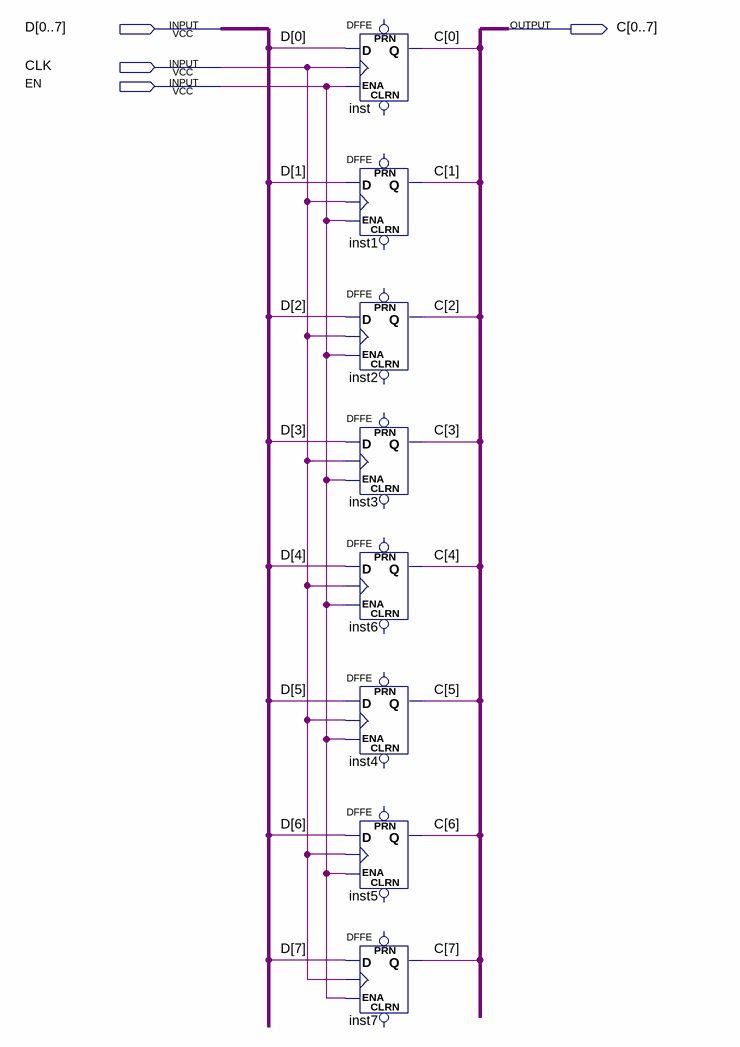
[diagram p0: schematic sheet]
// Quartus schematic reg8bit.bdf as structural Verilog: 8 symbols, 4 pins
module reg8bit (
  input  [0:7] D,
  input  CLK,
  input  EN,
  output [0:7] C
);

  DFFE inst (.D(D[0]), .CLK(CLK), .ENA(EN), .Q(C[0]));  // open: PRN, CLRN
  DFFE inst1 (.D(D[1]), .CLK(CLK), .ENA(EN), .Q(C[1]));  // open: PRN, CLRN
  DFFE inst2 (.D(D[2]), .CLK(CLK), .ENA(EN), .Q(C[2]));  // open: PRN, CLRN
  DFFE inst3 (.D(D[3]), .CLK(CLK), .ENA(EN), .Q(C[3]));  // open: PRN, CLRN
  DFFE inst6 (.D(D[4]), .CLK(CLK), .ENA(EN), .Q(C[4]));  // open: PRN, CLRN
  DFFE inst4 (.D(D[5]), .CLK(CLK), .ENA(EN), .Q(C[5]));  // open: PRN, CLRN
  DFFE inst5 (.D(D[6]), .CLK(CLK), .ENA(EN), .Q(C[6]));  // open: PRN, CLRN
  DFFE inst7 (.D(D[7]), .CLK(CLK), .ENA(EN), .Q(C[7]));  // open: PRN, CLRN
endmodule
